# EAGLE design btn-module (EAGLE 9.6.2)
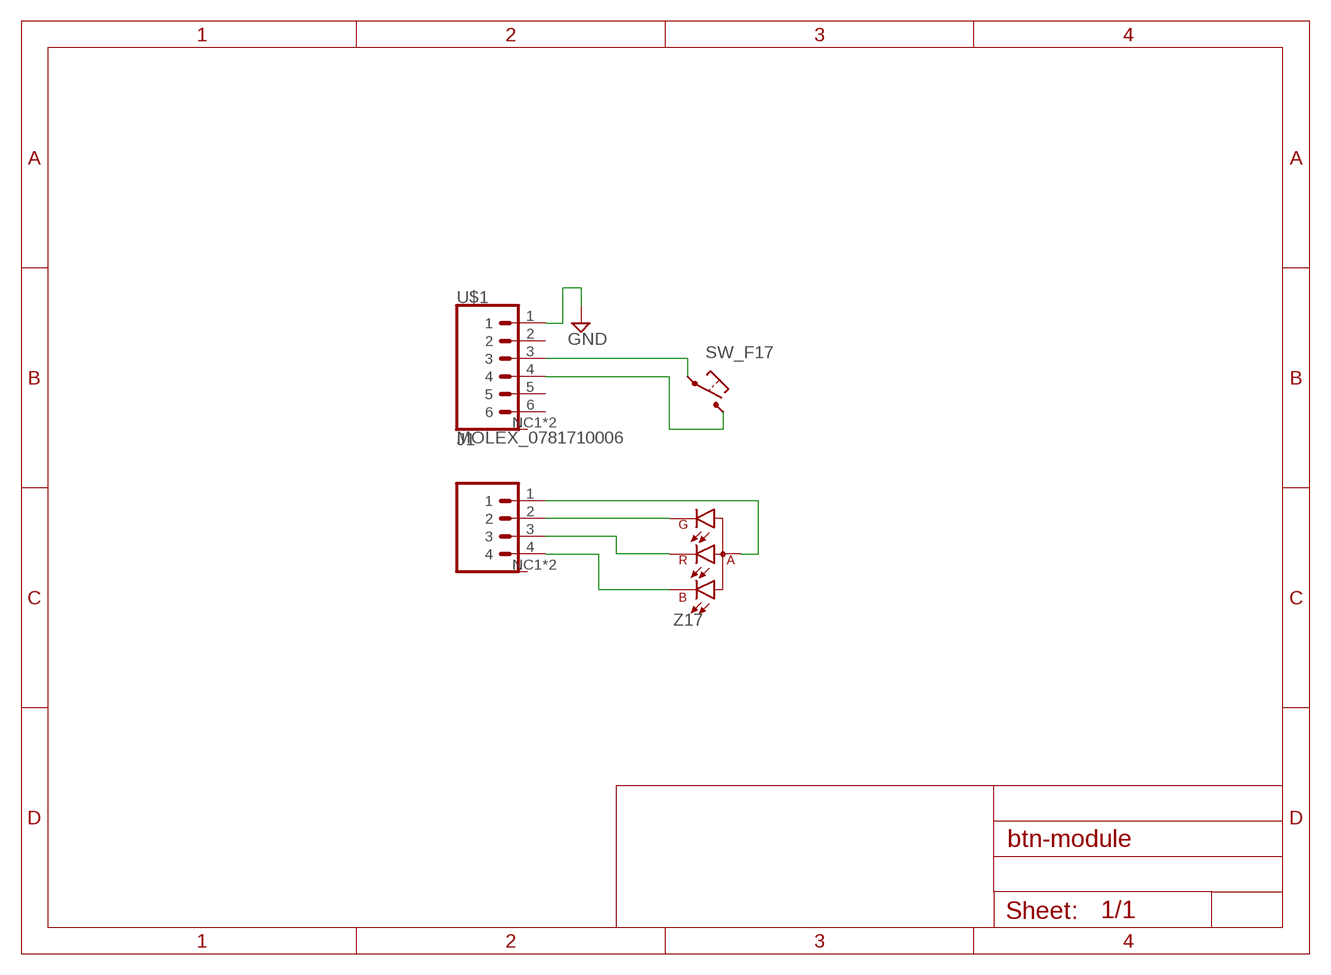
[diagram p0: schematic, sheet 1]

## Parts
J1  MOLEX_0781710004  [MOLEX_781710004]
SW_F17  MX-5-PIN-HOTSWAP-PAD  [MX-5-PIN-HOTSWAP-PAD]
U$1  MOLEX_0781710006  [MOLEX_781710006]
Z17  156120M173000  [156120M173000]

## Nets
GND: U$1.1
N$1: J1.2 Z17.4(G)
N$2: SW_F17.2@1(S) SW_F17.2@2(S) U$1.3
N$3: SW_F17.1@1(P) SW_F17.1@2(P) U$1.4
N$4: J1.3 Z17.3(R)
N$5: J1.4 Z17.2(B)
N$6: J1.1 Z17.1(A)
Unconnected: J1.NC1(M) J1.NC2(M) U$1.2 U$1.NC1(M) U$1.NC2(M)

## Power pins joined to a net without a drawn wire
5: U$1.5
6: U$1.6

## Library data of the parts
J1 = molex-pico-ezmate:MOLEX_0781710004: SMD 1.2mm pitch Molex Pico-EZmate 4P connector
SW_F17 = ts_keyboards:MX-5-PIN-HOTSWAP-PAD
U$1 = molex-pico-ezmate:MOLEX_0781710006
Z17 = ts_keyboards:156120M173000

## Board
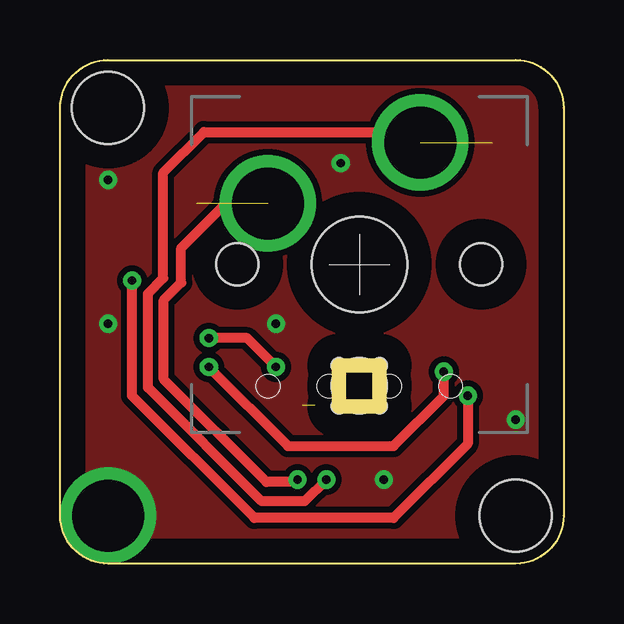
[diagram p1: board, top side]
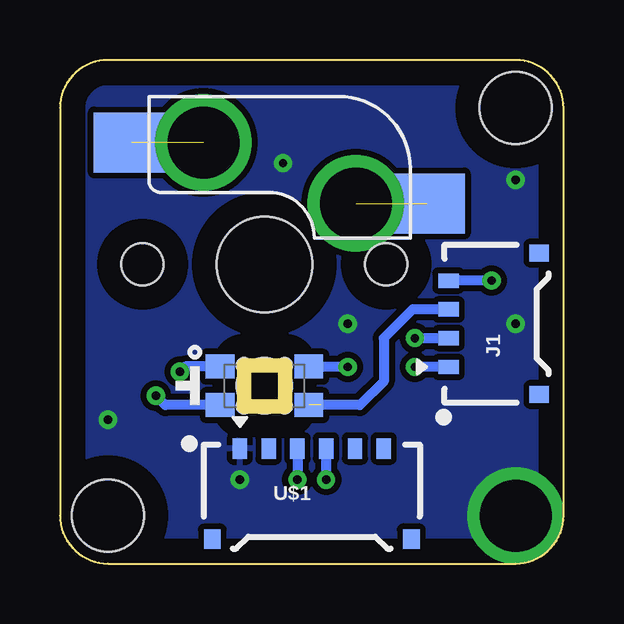
[diagram p2: board, bottom side, seen from below]

Size 21 x 21 mm. Coordinates in mm from the lower left corner, seen from the top.
Outline: 0,19 arc-90 2,21 19,21 arc-90 21,19 21,2 arc-90 19,0 2,0 arc-90 0,2 0,19
Copper layers (1*16): Top 0.035mm / dielectric 1.5mm / Bottom 0.035mm
Design rules "default *": minimum track width 6mil, minimum drill 0.35mm, track to track 10mil, track to pad 10mil, pad to pad 10mil, via to via 10mil, smd to smd 6mil, copper to edge 40mil, drill to drill 6mil, minimum pad ring 10mil, minimum via ring 8mil, stop-mask expansion 4mil, vias tented up to drill 0mil, thermal gap 10mil
Holes 3 mm at 2,19 19,2

### Footprints (pad centres in the part's own frame; a part is rotated, then mirrored left to right if it is on the bottom)
MOLEX_781710004 = smd 0.6 x 0.85: 1 -1.8,2; 2 -0.6,2; 3 0.6,2; 4 1.8,2 | smd 0.7 x 0.8: NC1 -2.95,-1.775; NC2 2.95,-1.775
MX-5-PIN-HOTSWAP-PAD = smd 3.15 x 2.5 bottom: 1@1 -6.785,2.54; 2@1 5.542,5.08 | drill 3 pad 3.75: 1@2 -3.81,2.54; 2@2 2.54,5.08 | hole 3.988: 0,0 | hole 1.75: -5.08,0; 5.08,0
MOLEX_781710006 = smd 0.6 x 0.85: 1 -3,2; 2 -1.8,2; 3 -0.6,2; 4 0.6,2; 5 1.8,2; 6 3,2 | smd 0.7 x 0.8: NC1 -4.15,-1.775; NC2 4.15,-1.775
156120M173000 = smd 1.2 x 1: 1 -1.85,0.8; 2 -1.85,-0.8; 3 1.85,-0.8; 4 1.85,0.8 | hole 0.6: -0.85,0.85; -0.85,-0.85; 0.85,0.85; 0.85,-0.85 | hole 2.3: 0,0

### Placement (x,y rotation side)
J1  2.8,10 90 bottom
SW_F17  12.47,12.47 0 top
U$1  10.5,2.8 0 bottom
Z17  12.47,7.41 0 bottom

### Tracks (layer width: path | path; a pad name or v marks a point on that pad's centre or on a via)
GND  (via drill 0.35, 3)
  other vias: 2,2 9,10 11.7,16.7 19,6 2,10 2,16 13.5,3.5
  pour Top: 1,21 0,20 0,1 1,0 20,0 21,1 21,20 20,21
  pour Bottom: 1,21 0,20 0,1 1,0 20,0 21,1 21,20 20,21
N$1  (via drill 0.35)
  Top 0.406: v9,8.2 7.8,9.4 v6.2,9.4
  Bottom 0.406: Z17.4 v9.01,8.21 v9,8.2 | v6.2,9.4 J1.2
N$2  (via drill 0.35)  (1 unrouted)
  Top 0.406: v11.1,3.5 10.2,2.6 8.4,2.6 3.66,7.34 3.66,11.26 4.3,11.9 4.3,16.3 6,18 14.57,18 SW_F17.2@2
  Bottom 0.406: U$1.3 v11.1,3.5
N$3  (via drill 0.35)  (1 unrouted)
  Top 0.406: v9.9,3.5 9.8,3.4 8.6,3.4 4.32,7.68 4.32,10.99 5.05,11.72 5.05,13.16 6.9,15.02 SW_F17.1@2
  Bottom 0.406: U$1.4 v9.9,3.5
N$4  (1 unrouted)
  Bottom 0.406: J1.3 6.3,10.6 7.5,9.4 7.5,7.6 8.49,6.61 10.11,6.61
N$5  (via drill 0.35)
  Top 0.406: v17,7 17,5 13.9,1.9 8.1,1.9 3,7 v3,11.8
  Bottom 0.406: Z17.2 16.61,6.61 v17,7 | v3,11.8 J1.4
N$6  (via drill 0.35)
  Top 0.406: v6.2,8.2 9.5,4.9 13.9,4.9 16,7 v16,8
  Bottom 0.406: J1.1 v6.2,8.2 | Z17.1 15.79,8.21 v16,8